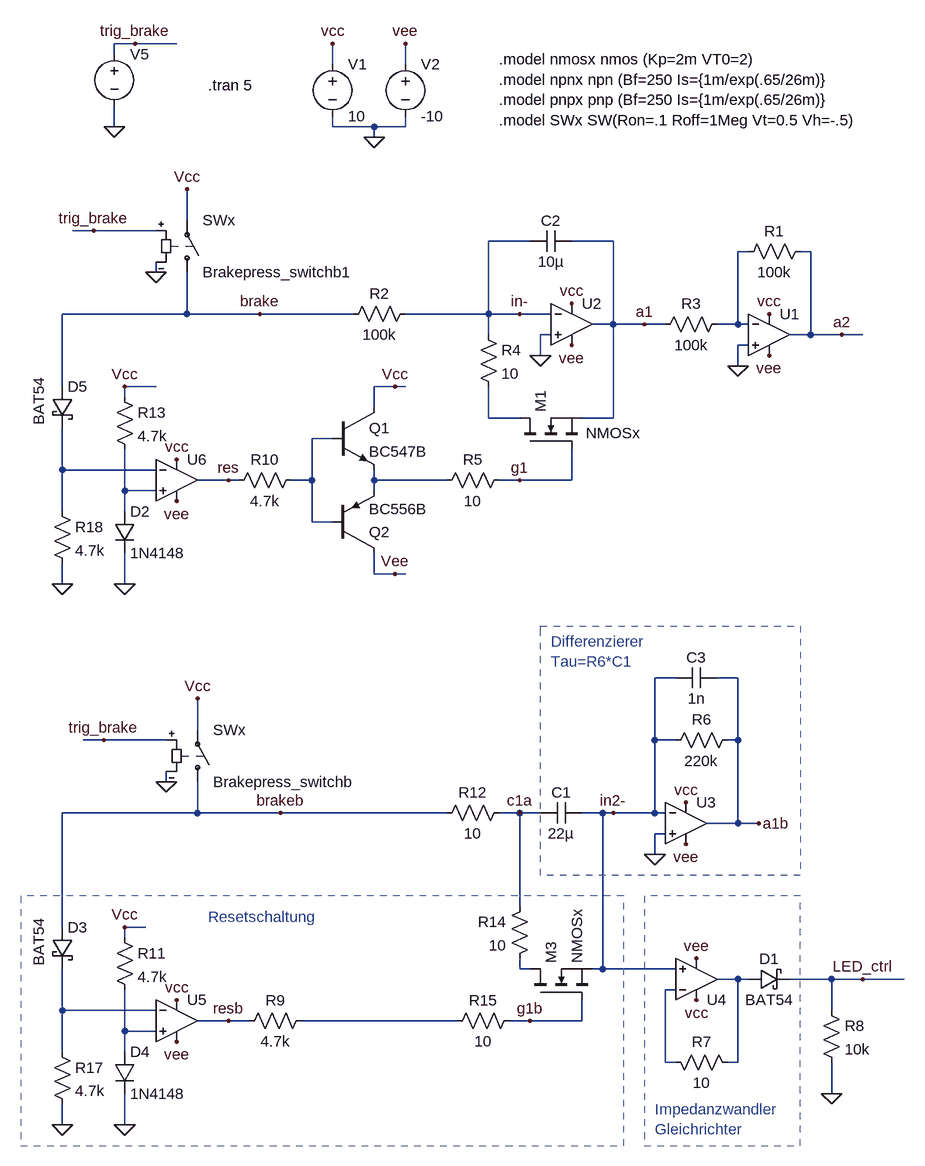
[diagram p0: schematic bl_int_v1.asc]
bl_int_v1.asc, the LTspice schematic file:
Version 4
SHEET 1 1200 2252
WIRE -480 192 -512 192
WIRE -416 192 -480 192
WIRE -512 208 -512 192
WIRE -176 224 -176 192
WIRE -64 224 -64 192
WIRE -512 320 -512 288
WIRE -176 320 -176 304
WIRE -112 320 -176 320
WIRE -64 320 -64 304
WIRE -64 320 -112 320
WIRE -112 336 -112 320
WIRE -400 464 -400 416
WIRE -544 480 -576 480
WIRE -448 480 -544 480
WIRE 128 496 64 496
WIRE 256 496 192 496
WIRE 464 512 448 512
WIRE 560 512 544 512
WIRE -448 544 -448 528
WIRE -400 608 -400 544
WIRE -400 608 -592 608
WIRE -288 608 -400 608
WIRE -144 608 -288 608
WIRE 64 608 64 496
WIRE 64 608 -64 608
WIRE 112 608 64 608
WIRE 160 608 112 608
WIRE 256 624 256 496
WIRE 256 624 224 624
WIRE 304 624 256 624
WIRE 336 624 304 624
WIRE 448 624 448 512
WIRE 448 624 416 624
WIRE 464 624 448 624
WIRE 64 640 64 608
WIRE 160 640 144 640
WIRE 560 640 560 512
WIRE 560 640 528 640
WIRE 608 640 560 640
WIRE 640 640 608 640
WIRE 464 656 448 656
WIRE 144 672 144 640
WIRE 448 688 448 656
WIRE -592 720 -592 608
WIRE -448 720 -496 720
WIRE -80 720 -112 720
WIRE -64 720 -80 720
WIRE -496 736 -496 720
WIRE -112 752 -112 720
WIRE 64 768 64 720
WIRE 112 768 64 768
WIRE 256 768 256 624
WIRE 256 768 208 768
WIRE -176 800 -208 800
WIRE -592 848 -592 784
WIRE -448 848 -592 848
WIRE -336 864 -384 864
WIRE -320 864 -336 864
WIRE -208 864 -208 800
WIRE -208 864 -240 864
WIRE -112 864 -112 848
WIRE 0 864 -112 864
WIRE 112 864 80 864
WIRE 192 864 192 816
WIRE 192 864 112 864
WIRE -496 880 -496 816
WIRE -448 880 -496 880
WIRE -112 880 -112 864
WIRE -592 912 -592 848
WIRE -496 912 -496 880
WIRE -208 928 -208 864
WIRE -176 928 -208 928
WIRE -112 1008 -112 976
WIRE -80 1008 -112 1008
WIRE -64 1008 -80 1008
WIRE -592 1024 -592 992
WIRE -496 1024 -496 976
WIRE 352 1168 320 1168
WIRE 448 1168 416 1168
WIRE -384 1248 -384 1200
WIRE -528 1264 -560 1264
WIRE -432 1264 -528 1264
WIRE 320 1264 320 1168
WIRE 352 1264 320 1264
WIRE 448 1264 448 1168
WIRE 448 1264 432 1264
WIRE -432 1328 -432 1312
WIRE -384 1376 -384 1328
WIRE -384 1376 -592 1376
WIRE -256 1376 -384 1376
WIRE 0 1376 -256 1376
WIRE 112 1376 80 1376
WIRE 144 1376 112 1376
WIRE 240 1376 208 1376
WIRE 256 1376 240 1376
WIRE 320 1376 320 1264
WIRE 320 1376 256 1376
WIRE 336 1376 320 1376
WIRE 448 1392 448 1264
WIRE 448 1392 400 1392
WIRE 480 1392 448 1392
WIRE 336 1408 320 1408
WIRE 320 1440 320 1408
WIRE 112 1520 112 1376
WIRE -592 1552 -592 1376
WIRE -464 1552 -496 1552
WIRE -496 1568 -496 1552
WIRE 112 1616 112 1600
WIRE 128 1616 112 1616
WIRE 240 1616 240 1376
WIRE 240 1616 224 1616
WIRE 352 1616 240 1616
WIRE 448 1632 416 1632
WIRE 464 1632 448 1632
WIRE 592 1632 528 1632
WIRE 640 1632 592 1632
WIRE 704 1632 640 1632
WIRE 352 1648 336 1648
WIRE -592 1680 -592 1616
WIRE -448 1680 -592 1680
WIRE 592 1680 592 1632
WIRE -336 1696 -384 1696
WIRE -304 1696 -336 1696
WIRE 16 1696 -224 1696
WIRE 128 1696 96 1696
WIRE 208 1696 208 1664
WIRE 208 1696 128 1696
WIRE -496 1712 -496 1648
WIRE -448 1712 -496 1712
WIRE -592 1744 -592 1680
WIRE -496 1744 -496 1712
WIRE 336 1760 336 1648
WIRE 352 1760 336 1760
WIRE 448 1760 448 1632
WIRE 448 1760 432 1760
WIRE 592 1808 592 1760
WIRE -592 1856 -592 1824
WIRE -496 1856 -496 1808
FLAG -112 336 0
FLAG -176 192 vcc
FLAG -64 192 vee
FLAG 192 656 vee
FLAG 192 592 vcc
FLAG 144 672 0
FLAG 496 672 vee
FLAG 496 608 vcc
FLAG 448 688 0
FLAG 112 608 in-
FLAG 304 624 a1
FLAG 608 640 a2
FLAG 368 1424 vee
FLAG 368 1360 vcc
FLAG 320 1440 0
FLAG 384 1600 vee
FLAG 384 1664 vcc
FLAG 256 1376 in2-
FLAG 480 1392 a1b
FLAG 640 1632 LED_ctrl
FLAG 592 1808 0
FLAG -512 320 0
FLAG -480 192 trig_brake
FLAG -528 1264 trig_brake
FLAG -432 1328 0
FLAG -384 1200 Vcc
FLAG 128 1696 g1b
FLAG -336 1696 resb
FLAG -80 1008 Vee
FLAG -80 720 Vcc
FLAG 112 864 g1
FLAG 112 1376 c1a
FLAG -416 1728 vee
FLAG -416 1664 vcc
FLAG -496 1856 0
FLAG -496 1552 Vcc
FLAG -256 1376 brakeb
FLAG -592 1856 0
FLAG -416 896 vee
FLAG -416 832 vcc
FLAG -496 1024 0
FLAG -496 720 Vcc
FLAG -592 1024 0
FLAG -544 480 trig_brake
FLAG -448 544 0
FLAG -400 416 Vcc
FLAG -288 608 brake
FLAG -336 864 res
SYMBOL voltage -176 208 R0
WINDOW 123 0 0 Left 2
WINDOW 39 0 0 Left 2
SYMATTR InstName V1
SYMATTR Value 10
SYMBOL voltage -64 208 R0
WINDOW 123 0 0 Left 2
WINDOW 39 0 0 Left 2
SYMATTR InstName V2
SYMATTR Value -10
SYMBOL Opamps\\UniversalOpamp2 192 624 R0
SYMATTR InstName U2
SYMBOL cap 128 512 R270
WINDOW 0 32 32 VTop 2
WINDOW 3 0 32 VBottom 2
SYMATTR InstName C2
SYMATTR Value 10µ
SYMBOL res -48 592 R90
WINDOW 0 0 56 VBottom 2
WINDOW 3 32 56 VTop 2
SYMATTR InstName R2
SYMATTR Value 100k
SYMBOL Opamps\\UniversalOpamp2 496 640 R0
SYMATTR InstName U1
SYMBOL res 448 528 R270
WINDOW 0 32 56 VTop 2
WINDOW 3 0 56 VBottom 2
SYMATTR InstName R1
SYMATTR Value 100k
SYMBOL res 320 640 R270
WINDOW 0 32 56 VTop 2
WINDOW 3 0 56 VBottom 2
SYMATTR InstName R3
SYMATTR Value 100k
SYMBOL res 48 624 R0
SYMATTR InstName R4
SYMATTR Value 10
SYMBOL Opamps\\UniversalOpamp2 368 1392 R0
SYMATTR InstName U3
SYMBOL cap 144 1392 R270
WINDOW 0 32 32 VTop 2
WINDOW 3 0 32 VBottom 2
SYMATTR InstName C1
SYMATTR Value 22µ
SYMBOL res 448 1248 R90
WINDOW 0 0 56 VBottom 2
WINDOW 3 32 56 VTop 2
SYMATTR InstName R6
SYMATTR Value 220k
SYMBOL Opamps\\UniversalOpamp2 384 1632 M180
SYMATTR InstName U4
SYMBOL res 336 1744 M90
WINDOW 0 0 56 VBottom 2
WINDOW 3 32 56 VTop 2
SYMATTR InstName R7
SYMATTR Value 10
SYMBOL res -16 1392 R270
WINDOW 0 32 56 VTop 2
WINDOW 3 0 56 VBottom 2
SYMATTR InstName R12
SYMATTR Value 10
SYMBOL cap 416 1152 R90
WINDOW 0 0 32 VBottom 2
WINDOW 3 32 32 VTop 2
SYMATTR InstName C3
SYMATTR Value 1n
SYMBOL schottky 464 1648 R270
WINDOW 0 32 32 VTop 2
WINDOW 3 0 32 VBottom 2
SYMATTR InstName D1
SYMATTR Value BAT54
SYMATTR Description Diode
SYMATTR Type diode
SYMBOL res 576 1664 R0
SYMATTR InstName R8
SYMATTR Value 10k
SYMBOL voltage -512 192 R0
WINDOW 3 -235 -375 Invisible 2
WINDOW 123 0 0 Left 2
WINDOW 39 0 0 Left 2
SYMATTR Value PWL(0 0 100m 0.001 101m 5 2 5 2.001 0 3 0.001 3.001 5 3.5 5 3.501 0)
SYMATTR InstName V5
SYMBOL sw -384 1344 M180
SYMATTR InstName Brakepress_switchb
SYMATTR Value SWx
SYMBOL nmos 128 1664 R270
SYMATTR InstName M3
SYMATTR Value NMOSx
SYMBOL res 112 1680 R90
WINDOW 0 0 56 VBottom 2
WINDOW 3 32 56 VTop 2
SYMATTR InstName R15
SYMATTR Value 10
SYMBOL res -208 1680 R90
WINDOW 0 0 56 VBottom 2
WINDOW 3 32 56 VTop 2
SYMATTR InstName R9
SYMATTR Value 4.7k
SYMBOL res 128 1504 M0
SYMATTR InstName R14
SYMATTR Value 10
SYMBOL nmos 112 816 R270
WINDOW 3 25 102 VRight 2
SYMATTR Value NMOSx
SYMATTR InstName M1
SYMBOL npn -176 752 R0
SYMATTR InstName Q1
SYMATTR Value BC547B
SYMBOL pnp -176 976 M180
SYMATTR InstName Q2
SYMATTR Value BC556B
SYMBOL res 96 848 R90
WINDOW 0 0 56 VBottom 2
WINDOW 3 32 56 VTop 2
SYMATTR InstName R5
SYMATTR Value 10
SYMBOL res -224 848 R90
WINDOW 0 0 56 VBottom 2
WINDOW 3 32 56 VTop 2
SYMATTR InstName R10
SYMATTR Value 4.7k
SYMBOL Opamps\\UniversalOpamp2 -416 1696 R0
SYMATTR InstName U5
SYMBOL res -512 1552 R0
SYMATTR InstName R11
SYMATTR Value 4.7k
SYMBOL res -608 1728 R0
SYMATTR InstName R17
SYMATTR Value 4.7k
SYMBOL diode -512 1744 R0
SYMATTR InstName D4
SYMATTR Value 1N4148
SYMBOL schottky -608 1552 R0
WINDOW 3 -20 -14 VRight 2
SYMATTR Value BAT54
SYMATTR InstName D3
SYMATTR Description Diode
SYMATTR Type diode
SYMBOL Opamps\\UniversalOpamp2 -416 864 R0
SYMATTR InstName U6
SYMBOL res -512 720 R0
SYMATTR InstName R13
SYMATTR Value 4.7k
SYMBOL res -608 896 R0
SYMATTR InstName R18
SYMATTR Value 4.7k
SYMBOL diode -512 912 R0
SYMATTR InstName D2
SYMATTR Value 1N4148
SYMBOL schottky -608 720 R0
WINDOW 3 -20 -14 VRight 2
SYMATTR Value BAT54
SYMATTR InstName D5
SYMATTR Description Diode
SYMATTR Type diode
SYMBOL sw -400 560 M180
SYMATTR InstName Brakepress_switchb1
SYMATTR Value SWx
TEXT -368 256 Left 2 !.tran 5
TEXT 80 216 Left 2 !.model nmosx nmos (Kp=2m VT0=2)\n.model npnx npn (Bf=250 Is={1m/exp(.65/26m)}\n.model pnpx pnp (Bf=250 Is={1m/exp(.65/26m)}\n.model SWx SW(Ron=.1 Roff=1Meg Vt=0.5 Vh=-.5)
TEXT -368 1536 Left 2 ;Resetschaltung
TEXT 160 1112 Left 2 ;Differenzierer\nTau=R6*C1
TEXT 320 1832 Left 2 ;Impedanzwandler \nGleichrichter
LINE Normal 48 1504 -656 1504 2
LINE Normal 48 1504 48 1504 2
LINE Normal 272 1504 48 1504 2
LINE Normal 272 1888 272 1504 2
LINE Normal -656 1888 272 1888 2
LINE Normal -656 1504 -656 1888 2
LINE Normal 144 1472 144 1104 2
LINE Normal 544 1472 144 1472 2
LINE Normal 544 1088 544 1472 2
LINE Normal 144 1088 544 1088 2
LINE Normal 144 1104 144 1088 2
LINE Normal 544 1504 304 1504 2
LINE Normal 544 1888 544 1504 2
LINE Normal 304 1888 544 1888 2
LINE Normal 304 1504 304 1888 2

The netlist it stands for:
* bl_int_v1.asc
V1 vcc 0 10
V2 vee 0 -10
XU2 0 in- vcc vee a1 level.2 Avol=1Meg GBW=10Meg Slew=10Meg ilimit=25m rail=0 Vos=0 phimargin=45 en=0 enk=0 in=0 ink=0 Rin=500Meg  ; pins IN+ IN- V+ V- OUT
C2 in- a1 10µ
R2 in- brake 100k
XU1 0 N001 vcc vee a2 level.2 Avol=1Meg GBW=10Meg Slew=10Meg ilimit=25m rail=0 Vos=0 phimargin=45 en=0 enk=0 in=0 ink=0 Rin=500Meg  ; pins IN+ IN- V+ V- OUT
R1 N001 a2 100k
R3 a1 N001 100k
R4 in- N002 10
XU3 0 in2- vcc vee a1b level.2 Avol=1Meg GBW=10Meg Slew=10Meg ilimit=25m rail=0 Vos=0 phimargin=45 en=0 enk=0 in=0 ink=0 Rin=500Meg  ; pins IN+ IN- V+ V- OUT
C1 c1a in2- 22µ
R6 a1b in2- 220k
XU4 in2- N009 vcc vee N008 level.2 Avol=1Meg GBW=10Meg Slew=10Meg ilimit=25m rail=0 Vos=0 phimargin=45 en=0 enk=0 in=0 ink=0 Rin=500Meg  ; pins IN+ IN- V+ V- OUT
R7 N009 N008 10
R12 brakeb c1a 10
C3 a1b in2- 1n
D1 N008 LED_ctrl BAT54
R8 LED_ctrl 0 10k
V5 trig_brake 0 PWL(0 0 100m 0.001 101m 5 2 5 2.001 0 3 0.001 3.001 5 3.5 5 3.501 0)
S§Brakepress_switchb brakeb vcc trig_brake 0 SWx
M3 N007 g1b in2- in2- NMOSx
R15 g1b N011 10
R9 N011 resb 4.7k
R14 c1a N007 10
M1 N002 g1 a1 a1 NMOSx
Q1 vcc N003 N005 0 BC547B
Q2 vee N003 N005 0 BC556B
R5 g1 N005 10
R10 N003 res 4.7k
XU5 N012 N010 vcc vee resb level.2 Avol=1Meg GBW=10Meg Slew=10Meg ilimit=25m rail=0 Vos=0 phimargin=45 en=0 enk=0 in=0 ink=0 Rin=500Meg  ; pins IN+ IN- V+ V- OUT
R11 vcc N012 4.7k
R17 N010 0 4.7k
D4 N012 0 1N4148
D3 brakeb N010 BAT54
XU6 N006 N004 vcc vee res level.2 Avol=1Meg GBW=10Meg Slew=10Meg ilimit=25m rail=0 Vos=0 phimargin=45 en=0 enk=0 in=0 ink=0 Rin=500Meg  ; pins IN+ IN- V+ V- OUT
R13 vcc N006 4.7k
R18 N004 0 4.7k
D2 N006 0 1N4148
D5 brake N004 BAT54
S§Brakepress_switchb1 brake vcc trig_brake 0 SWx
.model D D
.lib standard.dio
.model NPN NPN
.model PNP PNP
.lib standard.bjt
.model NMOS NMOS
.model PMOS PMOS
.lib standard.mos
.tran 5
.model nmosx nmos (Kp=2m VT0=2)
.model npnx npn (Bf=250 Is={1m/exp(.65/26m)}
.model pnpx pnp (Bf=250 Is={1m/exp(.65/26m)}
.model SWx SW(Ron=.1 Roff=1Meg Vt=0.5 Vh=-.5)
* Resetschaltung
* Differenzierer
* Tau=R6*C1
* Impedanzwandler
* Gleichrichter
.lib UniversalOpamps2.sub
.backanno
.end